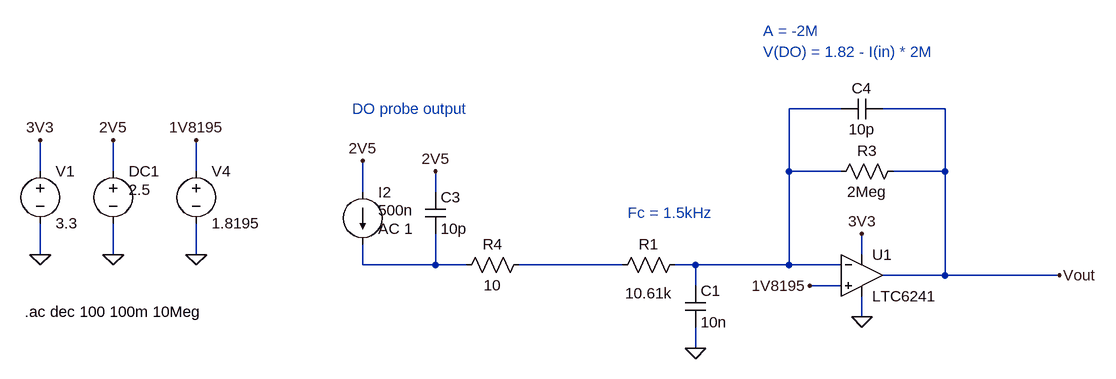
[diagram p0: schematic ltspice_opamp_rc.asc]
ltspice_opamp_rc.asc, the LTspice schematic file:
Version 4
SHEET 1 2600 680
WIRE 1264 16 1184 16
WIRE 1424 16 1328 16
WIRE 32 112 32 64
WIRE 144 112 144 64
WIRE 272 112 272 64
WIRE 1184 112 1184 16
WIRE 1264 112 1184 112
WIRE 1424 112 1424 16
WIRE 1424 112 1344 112
WIRE 528 144 528 96
WIRE 640 144 640 112
WIRE 32 240 32 192
WIRE 144 240 144 192
WIRE 272 240 272 192
WIRE 1296 240 1296 208
WIRE 528 256 528 224
WIRE 640 256 640 208
WIRE 640 256 528 256
WIRE 688 256 640 256
WIRE 928 256 768 256
WIRE 1040 256 1008 256
WIRE 1184 256 1184 112
WIRE 1184 256 1040 256
WIRE 1264 256 1184 256
WIRE 1424 272 1424 112
WIRE 1424 272 1328 272
WIRE 1600 272 1424 272
WIRE 1040 288 1040 256
WIRE 1264 288 1216 288
WIRE 1296 336 1296 304
WIRE 1040 384 1040 352
FLAG 1296 336 0
FLAG 1296 208 3V3
FLAG 272 64 1V8195
FLAG 272 240 0
FLAG 1600 272 Vout
FLAG 1216 288 1V8195
FLAG 144 64 2V5
FLAG 144 240 0
FLAG 528 96 2V5
FLAG 640 112 2V5
FLAG 1040 384 0
FLAG 32 64 3V3
FLAG 32 240 0
SYMBOL res 1360 96 R90
WINDOW 0 0 56 VBottom 2
WINDOW 3 32 56 VTop 2
SYMATTR InstName R3
SYMATTR Value 2Meg
SYMATTR SpiceLine tol=0.1 pwr=0.25
SYMBOL res 784 240 R90
WINDOW 0 0 56 VBottom 2
WINDOW 3 32 56 VTop 2
SYMATTR InstName R4
SYMATTR Value 10
SYMBOL voltage 272 96 R0
WINDOW 123 0 0 Left 0
WINDOW 39 0 0 Left 0
SYMATTR InstName V4
SYMATTR Value 1.8195
SYMBOL OpAmps\\LTC6241 1296 272 R0
SYMATTR InstName U1
SYMBOL voltage 144 96 R0
WINDOW 123 24 72 Left 2
WINDOW 39 0 0 Left 0
WINDOW 3 24 44 Left 2
SYMATTR InstName DC1
SYMATTR Value 2.5
SYMBOL current 528 144 R0
WINDOW 3 24 28 Left 2
WINDOW 123 24 56 Left 2
WINDOW 39 0 0 Left 0
SYMATTR Value 500n
SYMATTR Value2 AC 1
SYMATTR InstName I2
SYMBOL cap 624 144 R0
SYMATTR InstName C3
SYMATTR Value 10p
SYMATTR SpiceLine V=10
SYMBOL cap 1328 0 R90
WINDOW 0 0 32 VBottom 2
WINDOW 3 32 32 VTop 2
SYMATTR InstName C4
SYMATTR Value 10p
SYMBOL res 1024 240 R90
WINDOW 0 0 56 VBottom 2
WINDOW 3 44 56 VTop 2
SYMATTR InstName R1
SYMATTR Value 10.61k
SYMBOL cap 1024 288 R0
SYMATTR InstName C1
SYMATTR Value 10n
SYMBOL voltage 32 96 R0
WINDOW 123 0 0 Left 0
WINDOW 39 0 0 Left 0
SYMATTR InstName V1
SYMATTR Value 3.3
TEXT 1144 -104 Left 2 ;A = -2M
TEXT 1144 -72 Left 2 ;V(DO) = 1.82 - I(in) * 2M
TEXT 8 328 Left 2 !.ac dec 100 100m 10Meg
TEXT 512 16 Left 2 ;DO probe output
TEXT 936 176 Left 2 ;Fc = 1.5kHz

The netlist it stands for:
* ltspice_opamp_rc.asc
R3 Vout N001 2Meg tol=0.1 pwr=0.25
R4 N003 N002 10
V4 1V8195 0 1.8195
XU1 1V8195 N001 3V3 0 Vout LTC6241  ; pins In+ In- V+ V- OUT
V§DC1 2V5 0 2.5
I2 2V5 N002 500n AC 1
C3 2V5 N002 10p V=10
C4 Vout N001 10p
R1 N001 N003 10.61k
C1 N001 0 10n
V1 3V3 0 3.3
* A = -2M
* V(DO) = 1.82 - I(in) * 2M
.ac dec 100 100m 10Meg
* DO probe output
* Fc = 1.5kHz
.lib LTC4.lib
.backanno
.end